# EAGLE design ctecka_brana (EAGLE 6.5.0)
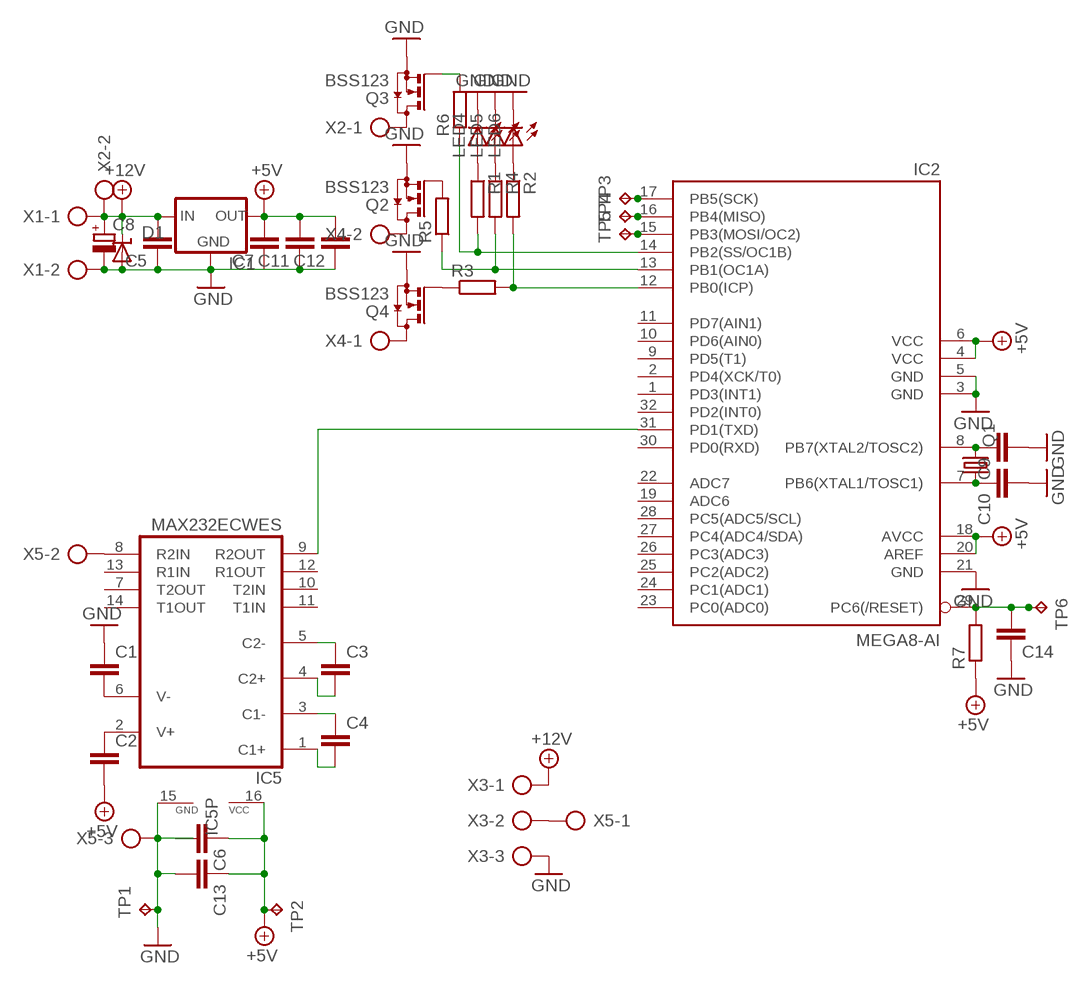
[diagram p0: schematic, sheet 1]

## Parts
C1  C-EUC0603  [C0603]
C2  C-EUC0603  [C0603]
C3  C-EUC0603  [C0603]
C4  C-EUC0603  [C0603]
C5  C-EUC0603  [C0603]
C6  C-EUC0603  [C0603]
C7  C-EUC0603  [C0603]
C8  CPOL-EUSMCD  [SMC_D]
C9  C-EUC0603  [C0603]
C10  C-EUC0603  [C0603]
C11  C-EUC0603  [C0603]
C12  C-EUC0603  [C0603]
C13  C-EUC0603  [C0603]
C14  C-EUC0603  [C0603]
D1  SUPPRESSOR-SMBG  [SMBG]
IC1  78LXXF  [SOT89R]
IC2  MEGA8-AI  [TQFP32-08]
IC5  MAX232ECWES  [SO16]
LED4  LEDCHIP-LED0805  [CHIP-LED0805]
LED5  LEDCHIP-LED0805  [CHIP-LED0805]
LED6  LEDCHIP-LED0805  [CHIP-LED0805]
Q1  CRYSTALCTS406  [CTS406]
Q2  BSS123  [SOT23]
Q3  BSS123  [SOT23]
Q4  BSS123  [SOT23]
R1  R-EU_R0603  [R0603]
R2  R-EU_R0603  [R0603]
R3  R-EU_R0603  [R0603]
R4  R-EU_R0603  [R0603]
R5  R-EU_R0603  [R0603]
R6  R-EU_R0603  [R0603]
R7  R-EU_R0603  [R0603]
TP1  TPB1,27  [B1,27]
TP2  TPB1,27  [B1,27]
TP3  TPB1,27  [B1,27]
TP4  TPB1,27  [B1,27]
TP5  TPB1,27  [B1,27]
TP6  TPB1,27  [B1,27]
X1  AK500/2  [AK500/2]
X2  AK500/2  [AK500/2]
X3  AK500/3  [AK500/3]
X4  AK500/2  [AK500/2]
X5  AK500/3  [AK500/3]

## Nets
+5V: C2.2 C6.1 C7.2 C11.2 C12.2 C13.1 IC1.2(OUT) IC2.4(VCC) IC2.6(VCC) IC2.18(AVCC) IC2.20(AREF) IC5.16(VCC) R7.1 TP2.TP
+12V: C5.2 C8.+ D1.C IC1.1(IN) X1.1 X2.2 X3.1
GND: C1.1 C5.1 C6.2 C7.1 C8.- C9.2 C10.2 C11.1 C12.1 C13.2 C14.1 D1.A IC1.3(GND) IC2.3(GND) IC2.5(GND) IC2.21(GND) IC5.15(GND) LED4.C LED5.C LED6.C Q2.2(S) Q3.2(S) Q4.2(S) TP1.TP X1.2 X3.3 X5.3
N$1: IC2.17(PB5(SCK)) TP3.TP
N$2: IC2.15(PB3(MOSI/OC2)) TP5.TP
N$3: Q3.3(D) X2.1
N$4: IC2.31(PD1(TXD)) IC5.9(R2OUT)
N$5: C3.1 IC5.5(C2-)
N$6: C4.1 IC5.3(C1-)
N$7: C1.2 IC5.6(V-)
N$8: C2.1 IC5.2(V+)
N$9: X3.2 X5.1
N$10: IC5.8(R2IN) X5.2
N$11: C4.2 IC5.1(C1+)
N$12: C3.2 IC5.4(C2+)
N$13: IC2.16(PB4(MISO)) TP4.TP
N$14: C14.2 IC2.29(PC6(/RESET)) R7.2 TP6.TP
N$15: C9.1 IC2.8(PB7(XTAL2/TOSC2)) Q1.3
N$16: C10.1 IC2.7(PB6(XTAL1/TOSC1)) Q1.1
N$17: Q2.1(G) R5.2
N$18: Q2.3(D) X4.2
N$19: Q4.1(G) R3.1
N$20: Q4.3(D) X4.1
N$21: LED4.A R1.1
N$22: LED5.A R4.1
N$23: LED6.A R2.1
N$24: Q3.1(G) R6.2
N$29: IC2.12(PB0(ICP)) R2.2 R3.2
N$30: IC2.13(PB1(OC1A)) R4.2 R5.1
N$31: IC2.14(PB2(SS/OC1B)) R1.2 R6.1
Unconnected: IC2.1(PD3(INT1)) IC2.2(PD4(XCK/T0)) IC2.9(PD5(T1)) IC2.10(PD6(AIN0)) IC2.11(PD7(AIN1)) IC2.19(ADC6) IC2.22(ADC7) IC2.23(PC0(ADC0)) IC2.24(PC1(ADC1)) IC2.25(PC2(ADC2)) IC2.26(PC3(ADC3)) IC2.27(PC4(ADC4/SDA)) IC2.28(PC5(ADC5/SCL)) IC2.30(PD0(RXD)) IC2.32(PD2(INT0)) IC5.7(T2OUT) IC5.10(T2IN) IC5.11(T1IN) IC5.12(R1OUT) IC5.13(R1IN) IC5.14(T1OUT)

## Library data of the parts
C1-C7 C9-C14 = rcl:C-EU: CAPACITOR, European symbol
C8 = rcl:CPOL-EU: POLARIZED CAPACITOR, European symbol
D1 = diode:SUPPRESSOR-: Suppressor diode
IC1 = v-reg:78LXXF
IC2 = atmel:MEGA8: MICROCONTROLLER 8 Kbytes FLASH, 1 kbytes SRAM, 512 bytes EEPROM, USART, 6-channel 10 bit ADC, 2-channel 8 bit ADC Pin compatible with Atmega48, ATMega88, ATMega168 Source: avr.lbr
IC5 = maxim:MAX232ECWE: RS232 TRANSEIVER
LED4-LED6 = led:LED: LED OSRAM: - CHIPLED LG R971, LG N971, LY N971, LG Q971, LY Q971, LO R971, LY R971 LH N974, LH R974 LS Q976, LO Q976, LY Q976 LO Q996 - Hyper CHIPLED LW Q18S LB Q993, LB Q99A, LB R99A - SideLED LS A670, LO A670, LY A670, LG A670, LP A670 LB A673, LV A673, LT A673, LW A673 LH A674 LY A675 LS A676, LA A676, LO A676, LY A676, LW A676 LS A679, LY A679, LG A679 - Hyper Micro SIDELED® LS Y876, LA Y876, LO Y876, LY Y876 LT Y87S - SmartLED LW L88C, LW L88S LB L89C, LB L89S, LG L890 LS L89K, LO L89K, LY L89K LS L896, LA L896, LO L896, LY L896 - TOPLED LS T670, LO T670, LY T670, LG T670, LP T670 LSG T670, LSP T670, LSY T670, LOP T670, LYG T670 LG T671, LOG T671, LSG T671 LB T673, LV T673, LT T673, LW T673 LH T674 LS T676, LA T676, LO T676, LY T676, LB T676, LH T676, LSB T676, LW T676 LB T67C, LV T67C, LT T67C, LS T67K, LO T67K, LY T67K, LW E67C LS E67B, LA E67B, LO E67B, LY E67B, LB E67C, LV E67C, LT E67C LW T67C LS T679, LY T679, LG T679 LS T770, LO T770, LY T770, LG T770, LP T770 LB T773, LV T773, LT T773, LW T773 LH T774 LS E675, LA E675, LY E675, LS T675 LS T776, LA T776, LO T776, LY T776, LB T776 LHGB T686 LT T68C, LB T68C - Hyper Mini TOPLED® LB M676 - Mini TOPLED Santana® LG M470 LS M47K, LO M47K, LY M47K Source: http://www.osram.convergy.de LUXEON: - LUMILED® LXK2-PW12-R00, LXK2-PW12-S00, LXK2-PW14-U00, LXK2-PW14-V00 LXK2-PM12-R00, LXK2-PM12-S00, LXK2-PM14-U00 LXK2-PE12-Q00, LXK2-PE12-R00, LXK2-PE12-S00, LXK2-PE14-T00, LXK2-PE14-U00 LXK2-PB12-K00, LXK2-PB12-L00, LXK2-PB12-M00, LXK2-PB14-N00, LXK2-PB14-P00, LXK2-PB14-Q00 LXK2-PR12-L00, LXK2-PR12-M00, LXK2-PR14-Q00, LXK2-PR14-R00 LXK2-PD12-Q00, LXK2-PD12-R00, LXK2-PD12-S00 LXK2-PH12-R00, LXK2-PH12-S00 LXK2-PL12-P00, LXK2-PL12-Q00, LXK2-PL12-R00 Source: www.luxeon.com KINGBRIGHT: KA-3528ASYC Source: www.kingbright.com
Q1 = crystal:CRYSTAL: CRYSTAL; OC_FARNELL: unknown; OC_NEWARK: unknown
Q2-Q4 = transistor-small-signal:BSS123: N-CHANNEL MOS FET
R1-R7 = rcl:R-EU_: RESISTOR, European symbol
TP1-TP6 = testpad:TP: Test pad
X1 X2 X4 = con-ptr500:AK500/2: CONNECTOR
X3 X5 = con-ptr500:AK500/3: CONNECTOR

## Board
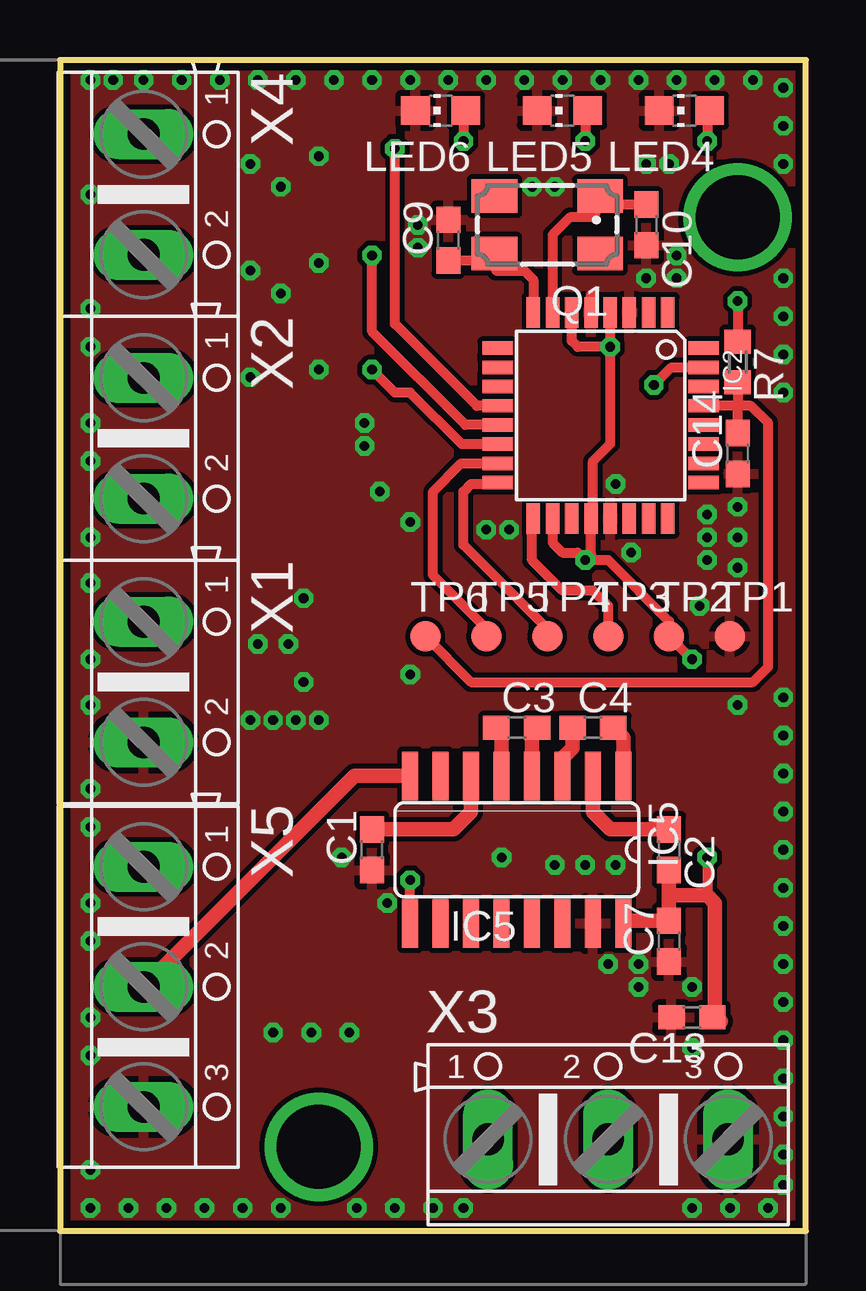
[diagram p1: board, top side]
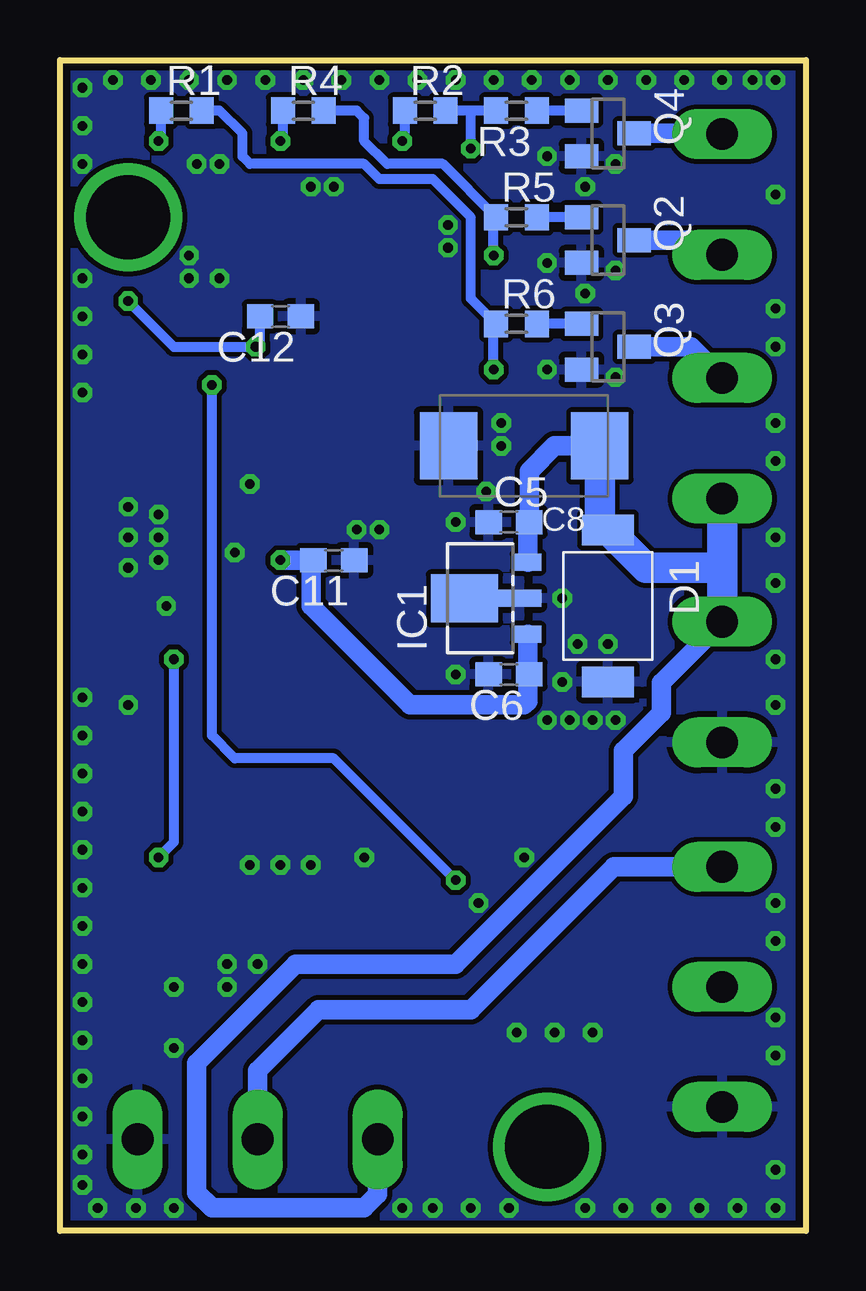
[diagram p2: board, bottom side, seen from below]

Size 31.09 x 48.79 mm. Coordinates in mm from the lower left corner, seen from the top.
Outline: 0,0 31.09,0 31.09,48.79 0,48.79 0,0
Copper layers (1*16): Top 0.035mm / dielectric 1.5mm / Bottom 0.035mm
Design rules "default *": minimum track width 10mil, minimum drill 0.4mm, track to track 8mil, track to pad 8mil, pad to pad 8mil, via to via 8mil, smd to smd 8mil, copper to edge 0.3mm, drill to drill 8mil, minimum pad ring 15mil, minimum via ring 8mil, stop-mask expansion 4mil, vias tented up to drill 0.6mm, thermal gap 10mil

### Footprints (pad centres in the part's own frame; a part is rotated, then mirrored left to right if it is on the bottom)
C0603 = smd 1.1 x 1: 1 -0.85,0; 2 0.85,0
SMC_D = smd 2.4 x 2.8: + -3.15,0; - 3.15,0
SMBG = smd 1.27 x 2.16: A 3.17,0; C -3.17,0
SOT89R = smd 0.7 x 1.1: 1 1.5,-1.75; 2 -1.5,-1.75 | smd 0.7 x 1.8: 3 0,-1.4 | smd 2 x 2.8: 4 0,0.9
TQFP32-08 = smd 1.27 x 0.559: 1 -4.293,2.8; 2 -4.293,2; 3 -4.293,1.2; 4 -4.293,0.4; 5 -4.293,-0.4; 6 -4.293,-1.2; 7 -4.293,-2; 8 -4.293,-2.8; 17 4.293,-2.8; 18 4.293,-2; 19 4.293,-1.2; 20 4.293,-0.4; 21 4.293,0.4; 22 4.293,1.2; 23 4.293,2; 24 4.293,2.8 | smd 0.559 x 1.27: 9 -2.8,-4.293; 10 -2,-4.293; 11 -1.2,-4.293; 12 -0.4,-4.293; 13 0.4,-4.293; 14 1.2,-4.293; 15 2,-4.293; 16 2.8,-4.293; 25 2.8,4.293; 26 2,4.293; 27 1.2,4.293; 28 0.4,4.293; 29 -0.4,4.293; 30 -1.2,4.293; 31 -2,4.293; 32 -2.8,4.293
SO16 = smd 0.66 x 2.032: 1 -4.445,-3.073; 2 -3.175,-3.073; 3 -1.905,-3.073; 4 -0.635,-3.073; 5 0.635,-3.073; 6 1.905,-3.073; 7 3.175,-3.073; 8 4.445,-3.073; 9 4.445,3.073; 10 3.175,3.073; 11 1.905,3.073; 12 0.635,3.073; 13 -0.635,3.073; 14 -1.905,3.073; 15 -3.175,3.073; 16 -4.445,3.073
CHIP-LED0805 = smd 1.2 x 1.2: A 0,-1.05; C 0,1.05
CTS406 = smd 1.9 x 1.4: 1 -2.2,-1.2; 2 2.2,-1.2; 3 2.2,1.2; 4 -2.2,1.2
SOT23 = smd 1 x 1.4: 1 -0.95,-1.1; 2 0.95,-1.1; 3 0,1.1
R0603 = smd 1 x 1.1: 1 -0.85,0; 2 0.85,0
B1,27 = smd 1.27 x 1.27: TP 0,0
AK500/2 = drill 1.321 long: 1 -2.515,0; 2 2.515,0
AK500/3 = drill 1.321 long: 1 -5.004,0; 2 0,0; 3 5.004,0

### Placement (x,y rotation side)
C1  13.01,15.88 90 top
C2  25.39,15.88 270 top
C3  19.05,20.96 0 top
C4  22.22,20.96 0 top
C5  12.38,29.53 0 bottom
C6  12.38,23.19 180 bottom
C7  25.39,12.07 90 top
C8  11.74,32.71 180 bottom
C9  16.19,41.28 90 top
C10  24.44,41.92 270 top
C11  19.68,27.95 180 bottom
C12  21.9,38.11 180 bottom
C13  26.35,8.9 180 top
C14  28.25,32.39 90 top
D1  8.25,26.04 270 bottom
IC1  13.33,26.36 90 bottom
IC2  22.54,33.98 270 top
IC5  19.05,15.88 180 top
LED4  26.03,46.68 90 top
LED5  20.95,46.68 90 top
LED6  15.87,46.68 90 top
Q1  20.31,41.92 180 top
Q2  8.25,41.28 270 bottom
Q3  8.25,36.84 270 bottom
Q4  8.25,45.73 270 bottom
R1  26.03,46.68 0 bottom
R2  15.87,46.68 0 bottom
R3  12.06,46.68 180 bottom
R4  20.95,46.68 0 bottom
R5  12.06,42.23 0 bottom
R6  12.06,37.79 0 bottom
R7  28.25,36.2 270 top
TP1  27.94,24.77 0 top
TP2  25.39,24.77 0 top
TP3  22.85,24.77 0 top
TP4  20.31,24.77 0 top
TP5  17.77,24.77 0 top
TP6  15.23,24.77 0 top
X1  3.49,22.87 270 top
X2  3.49,33.03 270 top
X3  22.85,3.82 0 top
X4  3.49,43.19 270 top
X5  3.49,10.17 270 top

### Tracks (layer width: path | path; a pad name or v marks a point on that pad's centre or on a via)
+5V  (via drill 0.4)
  Top 0.406: v22.94,36.84 22.94,32.79 22.22,32.08 22.22,29.77 IC2.20 22.14,28.18 v21.9,27.95 | v22.94,36.84 IC2.4 | IC2.6 21.34,37.09 21.59,36.84 v22.94,36.84 | IC2.18 20.54,28.68 20.95,28.27 21.59,28.27 v21.9,27.95 | v21.9,27.95 22.85,27.95 25.39,25.41 TP2.TP v26.35,23.82 | v28.25,38.74 R7.1 | v26.98,15.56 26.98,13.98
  Top 0.61: IC5.16 23.6,12.92 C7.2 25.39,13.98 | 25.39,13.98 C2.2 | 27.55,8.73 C13.1 27.3,9 27.3,13.66 26.98,13.98 25.39,13.98
  Bottom 0.406: C12.2 22.75,37.02 v22.94,36.84 26.35,36.84 v28.25,38.74 | IC1.2 11.58,23.24 C6.1 | v26.35,23.82 26.35,16.2 v26.98,15.56
  Bottom 0.813: IC1.2 11.58,22.08 11.74,21.91 16.5,21.91 20.63,26.04 20.63,27.84 C11.2 v21.9,27.95
+12V
  Bottom 0.813: C8.+ 10.47,32.71 11.53,31.66 C5.2 11.58,29.48 IC1.1 | X3.1 17.85,1.52 18.41,0.96 24.76,0.96 25.39,1.59 25.39,6.99 21.27,11.12 14.6,11.12 7.61,18.1 7.61,20.01 6.03,21.6 6.03,22.84 X1.1
  Bottom 1.27: X1.1 3.49,27.63 | 3.49,27.63 X2.2 | 3.49,27.63 6.67,27.63 D1.C 8.59,29.55 C8.+
GND  (via drill 0.4)
  Top 0.406: IC2.5 22.14,38.98 22.22,39.06
  other vias: 10.15,22.87 8.88,21.28 9.84,21.28 10.79,21.28 7.93,21.28 23.17,15.25 21.9,15.25 20.63,15.25 18.73,29.22 17.77,29.22 14.6,23.19 14.92,41.92 14.92,40.97 25.71,39.7 25.71,40.65 19.68,43.51 20.63,43.51 24.44,44.46 25.39,44.46 10.79,44.78 9.2,43.51 7.93,44.46 10.79,40.33 9.2,39.06 7.93,40.01 10.79,35.88 7.93,35.57 24.44,39.7 23.17,31.12 23.81,28.27 28.25,30.17 10.15,26.36 14.6,29.53 13.33,30.8 12.7,32.71 12.7,33.66 8.25,24.45 9.52,24.45 24.12,11.12 24.12,10.17 26.35,10.17 26.35,7.63 22.85,11.12 13.65,13.66 11.74,15.56 1.27,0.96 2.85,0.96 4.44,0.96 6.03,0.96 7.61,0.96 9.2,0.96 16.82,0.96 12.38,0.96 13.96,0.96 15.55,0.96 26.35,0.96 27.94,0.96 29.52,0.96 30.16,1.91 30.16,3.18 30.16,12.71 30.16,14.3 30.16,15.88 30.16,17.47 30.16,19.06 30.16,4.77 30.16,6.36 30.16,7.95 30.16,9.53 30.16,11.12 30.16,38.11 30.16,47.63 25.71,47.95 24.12,47.95 22.54,47.95 20.95,47.95 30.16,39.7 28.89,47.95 27.3,47.95 30.16,44.46 30.16,46.05 19.36,47.95 9.84,47.95 8.25,47.95 6.66,47.95 5.07,47.95 3.49,47.95 17.77,47.95 16.19,47.95 14.6,47.95 13.01,47.95 11.42,47.95 30.16,20.65 26.98,28.9 28.25,27.63 28.25,28.9 30.16,34.93 30.16,36.52 30.16,22.23 28.25,21.91 26.66,26.04 26.98,27.95 26.98,29.85 1.27,32.08 1.27,23.82 1.27,43.19 1.27,28.9 2.22,47.95 1.27,47.95 1.27,33.66 1.27,26.99 1.27,36.84 1.27,38.42 1.27,21.91 1.27,2.55 1.27,12.07 1.27,13.66 10.47,8.26 1.27,16.84 1.27,18.42 18.41,15.56 12.06,8.26 1.27,7.31 1.27,8.9 8.88,8.26
  pour Bottom: -0.96,48.9 35.24,49.22 35.87,-16.5 -0.32,-16.82
  pour Top: -1.28,48.9 35.55,48.9 36.19,-16.82 -0.64,-16.82
N$1
  Top 0.406: TP3.TP 22.85,26.04 22.22,26.68 20.95,26.68 19.68,27.95 19.68,29.63 IC2.17
N$2
  Top 0.406: TP5.TP 17.77,25.09 15.55,27.31 15.55,30.8 16.73,31.98 IC2.15
N$3
  Bottom 0.813: X2.1 4.78,36.84 Q3.3
N$4  (via drill 0.4)
  Top 0.406: v24.76,35.25 25.49,35.98 IC2.31 | IC5.9 v14.6,14.61
  Bottom 0.406: v24.76,35.25 24.76,20.65 23.81,19.69 19.68,19.69 v14.6,14.61
N$5
  Top 0.61: IC5.5 18.41,20.75 arc90 C3.1
N$6
  Top 0.61: IC5.3 20.95,19.69 21.37,20.11 C4.1
N$7
  Top 0.61: IC5.6 17.14,17.47 16.4,16.73 C1.2
N$8
  Top 0.61: IC5.2 22.22,17.47 22.96,16.73 C2.1
N$9
  Bottom 0.813: X5.1 8.01,15.17 13.97,9.21 20.31,9.21 22.85,6.68 X3.2
N$10
  Top 0.61: X5.2 12.28,18.96 IC5.8
N$11
  Top 0.61: IC5.1 23.49,20.54 C4.2
N$12
  Top 0.61: IC5.4 19.68,20.75 arc-90 C3.2
N$13
  Top 0.406: TP4.TP 20.31,25.09 16.82,28.58 16.82,30.8 17.14,31.12 18.19,31.12 IC2.16
N$14
  Top 0.406: TP6.TP 17.14,22.87 28.89,22.87 29.52,23.5 29.52,33.66 28.81,34.38 28.25,34.38 | 28.25,34.38 IC2.29 | R7.2 28.25,34.38 | C14.2 28.25,34.38
N$15
  Top 0.406: IC2.8 19.74,39.64 19.36,40.01 18.19,40.01 Q1.3 17.77,40.43 C9.1
N$16
  Top 0.406: IC2.7 20.54,41.51 21.27,42.23 22.27,42.23 Q1.1 22.55,42.77 C10.1
N$17
  Bottom 0.406: Q2.1 R5.2
N$18
  Bottom 0.813: X4.2 4.1,41.28 Q2.3
N$19
  Bottom 0.406: Q4.1 R3.1
N$20
  Bottom 0.813: X4.1 3.51,45.73 Q4.3
N$21  (via drill 0.4)
  Top 0.406: LED4.A 26.98,46.58 v26.98,45.41
  Bottom 0.406: v26.98,45.41 26.88,45.51 R1.1
N$22  (via drill 0.4)
  Top 0.406: LED5.A 21.9,46.58 v21.9,45.41
  Bottom 0.406: v21.9,45.41 21.8,45.51 R4.1
N$23  (via drill 0.4)
  Top 0.406: LED6.A 16.82,46.58 v16.82,45.41
  Bottom 0.406: v16.82,45.41 16.72,45.51 R2.1
N$24
  Bottom 0.406: Q3.1 R6.2
N$25  (via drill 3.5)
  other vias: 10.79,3.5
N$29  (via drill 0.4)
  Top 0.406: IC2.12 17.38,34.38 13.97,37.79 v13.97,45.09
  Bottom 0.406: R3.2 13.97,46.68 | 13.97,46.68 R2.2 | v13.97,45.09 13.97,46.68
N$30  (via drill 0.4)
  Top 0.406: IC2.13 16.91,33.58 13.01,37.47 v13.01,40.65
  Bottom 0.406: R4.2 18.73,46.68 18.41,46.36 18.41,45.41 17.46,44.46 15.13,44.46 R5.1 13.01,42.13 v13.01,40.65
N$31  (via drill 0.4)
  Top 0.406: IC2.14 16.75,32.78 14.6,34.93 13.97,34.93 v13.01,35.88
  Bottom 0.406: R1.2 24.44,46.68 23.49,45.73 23.49,44.78 23.17,44.46 18.41,44.46 17.77,43.82 15.55,43.82 13.97,42.23 13.97,38.84 R6.1 13.01,37.69 v13.01,35.88
N$128  (via drill 3.5)
  other vias: 28.25,42.23

### Text on the board
tDocu: OUT1 | OUT2 | OUT3 | +12V | MOSI | MISO | RST | SCK | VCC | GND | +12V | GND | <-TX | 12V | RFID | GND | ->RX | GND